# Altium schematic sheet MicroSD.SchDoc
size A4; SheetNumber: 6; SheetTotal: 9
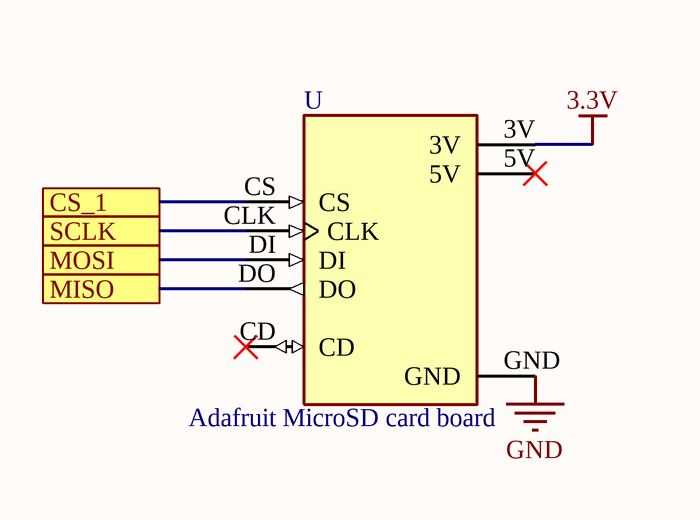
[diagram p0: MicroSD.SchDoc]

## Parts
U  Adafruit MicroSD card board  [MODULE_254]

## Ports
CS_1, MISO, MOSI, SCLK

## Nets
3.3V: U.3V
GND: U.GND
CS_1: U.CS ; port CS_1
MISO: U.DO ; port MISO
MOSI: U.DI ; port MOSI
SCLK: U.CLK ; port SCLK

Not connected (* = marked no-connect by the designer): U 5V* CD*

## Notes on the sheet
- Title:
- Size:
- Date:
- A4
- Author:
- Revision:
- Sheet
- of
- File:

## Library data of the parts
U = 254: MICROSD CARD BREAKOUT 5V OR 3V; Package: None; MP: 254; Value: *; Price: None; Availability: Unavailable; SnapEDA_Link: https://www.snapeda.com/parts/254/Adafruit%20Industries/view-part/4653174/?ref=snap; MF: Adafruit